# EAGLE design PennyMan_Ard_R3_Shield_v9.4 (EAGLE 9.0.0)
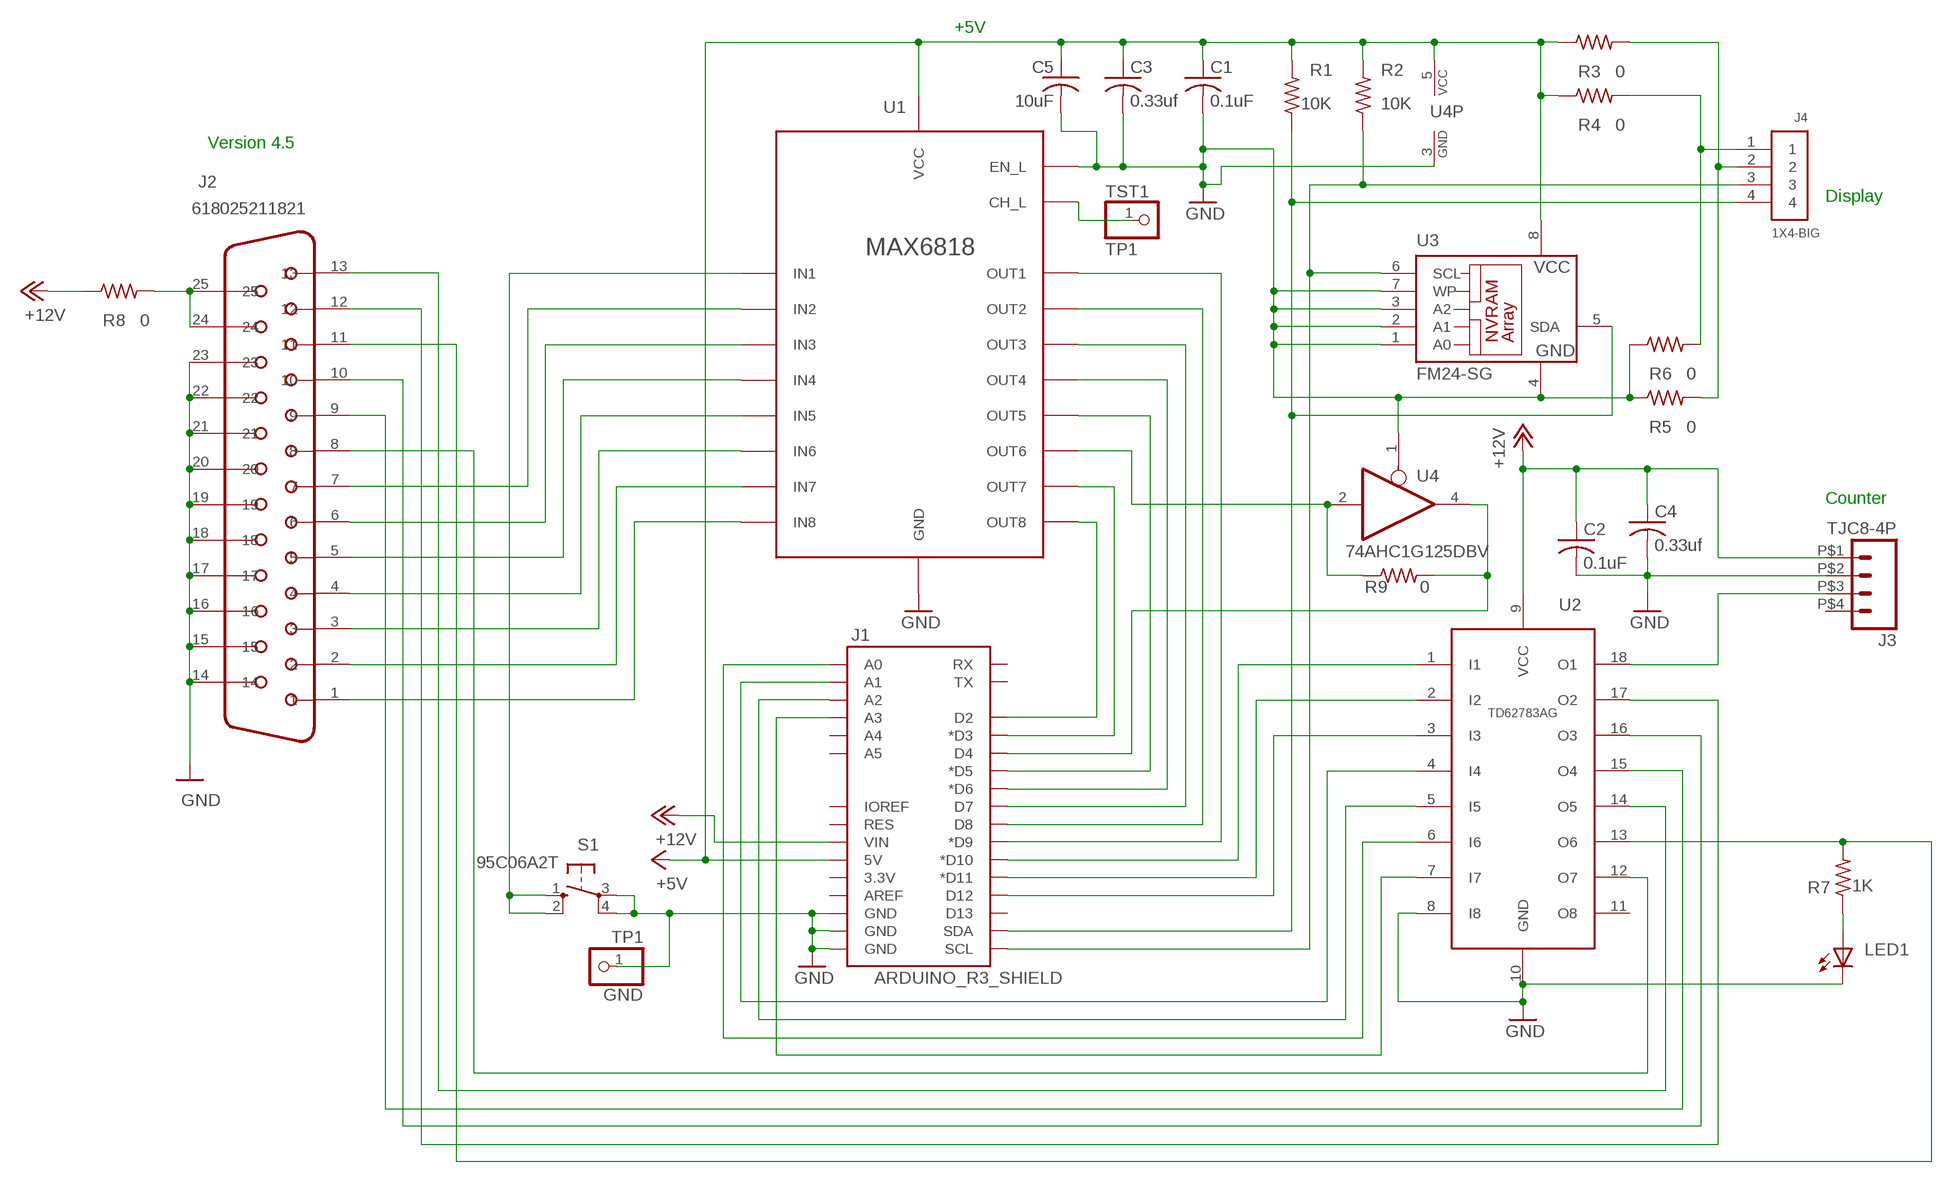
[diagram p0: schematic, sheet 1]

## Parts
C1  0.1uF  C-USC0805  [C0805]
C2  0.1uF  C-USC0805  [C0805]
C3  0.33uf  C-USC1206  [C1206]
C4  0.33uf  C-USC1206  [C1206]
C5  10uF  C-USC1812  [C1812]
GND  TP1  PINHD-1X1  [1X01]
J1  ARDUINO_R3_SHIELD  [UNO_R3_SHIELD]
J2  618025211821  [618025211821]
J3  TJC8-4P  [TJC8-4P]
J4  1X4-BIG  [1X04-BIG]
LED1  LEDSML0805  [SML0805]
R1  10K  R-US_R0805  [R0805]
R2  10K  R-US_R0805  [R0805]
R3  0  R-US_R0805  [R0805]
R4  0  R-US_R0805  [R0805]
R5  0  R-US_R0805  [R0805]
R6  0  R-US_R0805  [R0805]
R7  1K  R-US_R0805  [R0805]
R8  0  R-US_R0805  [R0805]
R9  0  R-US_R0805  [R0805]
S1  95C06A2T  10-XX  [B3F-10XX]
TST1  TP1  PINHD-1X1  [1X01]
U1  MAX6818  [SSOP20]
U2  TD62783AG  [SOP18]
U3  FM24-SG  [SO8]
U4  74AHC1G125DBV  [SOT23-5]

## Nets
+5V: C1.1 C3.1 C5.1 J1.5V R1.2 R2.2 R3.1 R4.1 U1.VCC U3.8(VCC) U4.5(VCC)
+12V: C2.1 C4.1 J1.VIN J3.P$1 R8.1 U2.9(VCC)
GND: C1.2 C2.2 C3.2 C4.2 C5.2 GND.1 J1.GND@0(GND) J1.GND@1(GND) J1.GND@2(GND) J2.14 J2.15 J2.16 J2.17 J2.18 J2.19 J2.20 J2.21 J2.22 J2.23 J3.P$2 LED1.C R5.1 R6.1 S1.3(P) S1.4(P1) U1.EN_L U1.GND U2.8(I8) U2.10(GND) U3.1(A0) U3.2(A1) U3.3(A2) U3.4(GND) U3.7(WP) U4.1(OE) U4.3(GND)
N$1: J2.1 U1.IN8
N$2: J2.2 U1.IN7
N$3: J2.3 U1.IN6
N$4: J2.4 U1.IN5
N$5: J2.5 U1.IN4
N$6: J2.6 U1.IN3
N$7: J2.7 U1.IN2
N$8: J1.D9(*D9) U1.OUT1
N$9: J1.D8 U1.OUT2
N$10: J1.D7 U1.OUT3
N$11: J1.D6(*D6) U1.OUT4
N$12: J1.D5(*D5) U1.OUT5
N$14: J1.D3(*D3) U1.OUT7
N$15: J3.P$3 U2.18(O1)
N$16: J1.D2 U1.OUT8
N$17: J1.A0 U2.6(I6)
N$18: J1.D10(*D10) U2.1(I1)
N$19: J1.D11(*D11) U2.2(I2)
N$20: J1.D12 U2.3(I3)
N$21: J1.A1 U2.4(I4)
N$22: J2.12 U2.17(O2)
N$23: J2.10 U2.16(O3)
N$24: J2.9 U2.15(O4)
N$25: TST1.1 U1.CH_L
N$26: J1.SCL J4.3 R2.1 U3.6(SCL)
N$27: J2.13 U2.14(O5)
N$28: J4.1 R4.2 R6.2
N$29: J1.SDA J4.4 R1.1 U3.5(SDA)
N$30: J4.2 R3.2 R5.2
N$31: J1.D4 R9.2 U4.4(O)
N$32: J1.A2 U2.5(I5)
N$33: LED1.A R7.1
N$34: J2.11 R7.2 U2.13(O6)
N$35: S1.1(S) S1.2(S1) U1.IN1
N$36: J1.A3 U2.7(I7)
N$37: J2.8 U2.12(O7)
N$38: J2.24 J2.25 R8.2
N$40: R9.1 U1.OUT6 U4.2(I)
Unconnected: J1.3.3V J1.A4 J1.A5 J1.AREF J1.D13 J1.IOREF J1.RES J1.RX J1.TX J3.P$4 U2.11(O8)

## Notes on the sheet
- +5V
- Version 4.5
- Display
- Counter

## Library data of the parts
C1-C5 = resistor:C-US: CAPACITOR, American symbol
GND TST1 = adafruit:PINHD-1X1: Pin header 1x1 for 0.1" spacing With round pins
J1 = SparkFun-Boards:ARDUINO_R3_SHIELD: Shield form compatible with the Arduino Uno R3.
J2 = EagleLibrary_Wuerth_Elektronik_eiCan_Communication_Connectors_v4_20150113:618025211821: WR-DSUB 8.08mm Female Angled PCB Connector without Hex Screw, 25 Pins=>Code : Con_I-O_DSUB_PCB_Female_wo-screw_618025211821 <http://katalog.we-online.de/media/images/eican/Con_I-O_DSUB_PCB_Female_wo-screw_6180xx211821_pf2.jpg> Details see: http://katalog.we-online.de/en/em/618_0xx_211_821 Created 2014-07-10, Karrer Zheng 2014 (C) Würth Elektronik
J3 = NDN:TJC8-4P
J4 = adafruit:1X4: 4-pin connector
LED1 = led:LED: LED OSRAM: - CHIPLED LG R971, LG N971, LY N971, LG Q971, LY Q971, LO R971, LY R971 LH N974, LH R974 LS Q976, LO Q976, LY Q976 LO Q996 - Hyper CHIPLED LW Q18S LB Q993, LB Q99A, LB R99A - SideLED LS A670, LO A670, LY A670, LG A670, LP A670 LB A673, LV A673, LT A673, LW A673 LH A674 LY A675 LS A676, LA A676, LO A676, LY A676, LW A676 LS A679, LY A679, LG A679 - Hyper Micro SIDELED® LS Y876, LA Y876, LO Y876, LY Y876 LT Y87S - SmartLED LW L88C, LW L88S LB L89C, LB L89S, LG L890 LS L89K, LO L89K, LY L89K LS L896, LA L896, LO L896, LY L896 - TOPLED LS T670, LO T670, LY T670, LG T670, LP T670 LSG T670, LSP T670, LSY T670, LOP T670, LYG T670 LG T671, LOG T671, LSG T671 LB T673, LV T673, LT T673, LW T673 LH T674 LS T676, LA T676, LO T676, LY T676, LB T676, LH T676, LSB T676, LW T676 LB T67C, LV T67C, LT T67C, LS T67K, LO T67K, LY T67K, LW E67C LS E67B, LA E67B, LO E67B, LY E67B, LB E67C, LV E67C, LT E67C LW T67C LS T679, LY T679, LG T679 LS T770, LO T770, LY T770, LG T770, LP T770 LB T773, LV T773, LT T773, LW T773 LH T774 LS E675, LA E675, LY E675, LS T675 LS T776, LA T776, LO T776, LY T776, LB T776 LHGB T686 LT T68C, LB T68C - Hyper Mini TOPLED® LB M676 - Mini TOPLED Santana® LG M470 LS M47K, LO M47K, LY M47K Source: http://www.osram.convergy.de LUXEON: - LUMILED® LXK2-PW12-R00, LXK2-PW12-S00, LXK2-PW14-U00, LXK2-PW14-V00 LXK2-PM12-R00, LXK2-PM12-S00, LXK2-PM14-U00 LXK2-PE12-Q00, LXK2-PE12-R00, LXK2-PE12-S00, LXK2-PE14-T00, LXK2-PE14-U00 LXK2-PB12-K00, LXK2-PB12-L00, LXK2-PB12-M00, LXK2-PB14-N00, LXK2-PB14-P00, LXK2-PB14-Q00 LXK2-PR12-L00, LXK2-PR12-M00, LXK2-PR14-Q00, LXK2-PR14-R00 LXK2-PD12-Q00, LXK2-PD12-R00, LXK2-PD12-S00 LXK2-PH12-R00, LXK2-PH12-S00 LXK2-PL12-P00, LXK2-PL12-Q00, LXK2-PL12-R00 Source: www.luxeon.com KINGBRIGHT: KA-3528ASYC Source: www.kingbright.com
R1-R9 = resistor:R-US_: RESISTOR, American symbol
S1 = switch-omron:10-XX: OMRON SWITCH
U1 = NDN:MAX6818
U2 = NDN:TD62783AG: Octal High-side driver
U3 = ramtron:FM24*: I2C NVRAM 8 pin
U4 = 74xx-little-us:74*1G125: Single Bus Buffer Gate with 3-State Output

## Net classes
0 default: clearance 0.205 mm

## Board
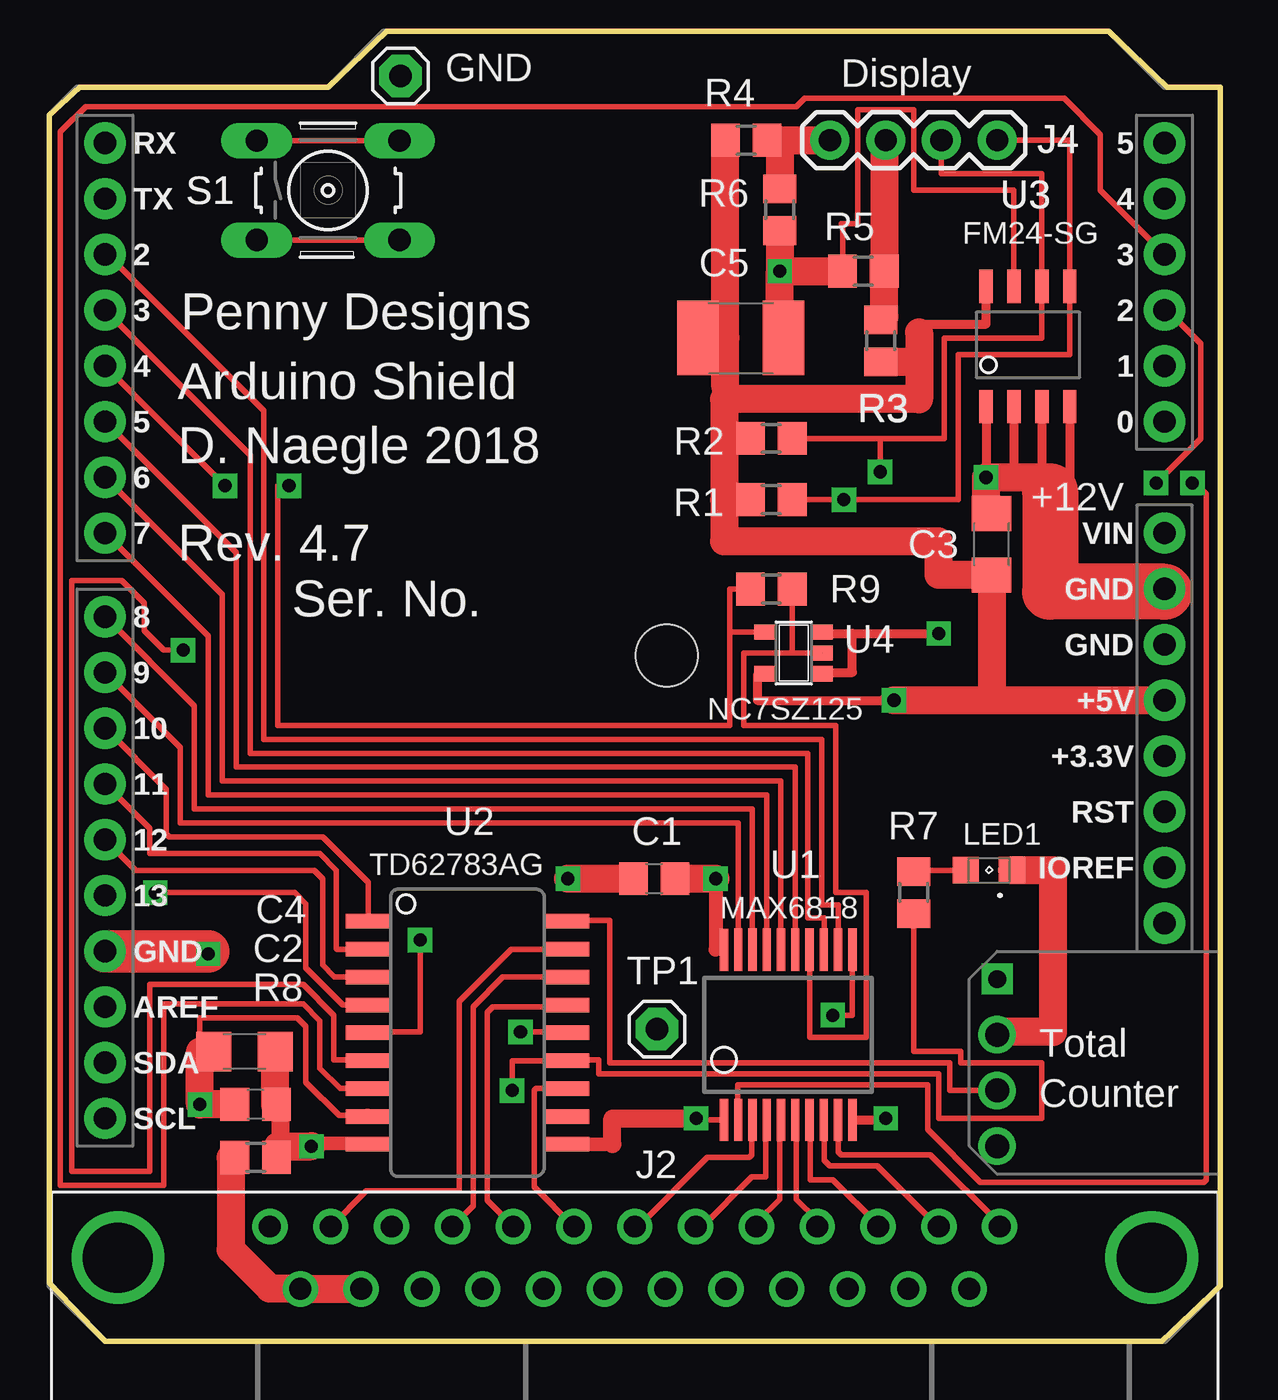
[diagram p1: board, top side]
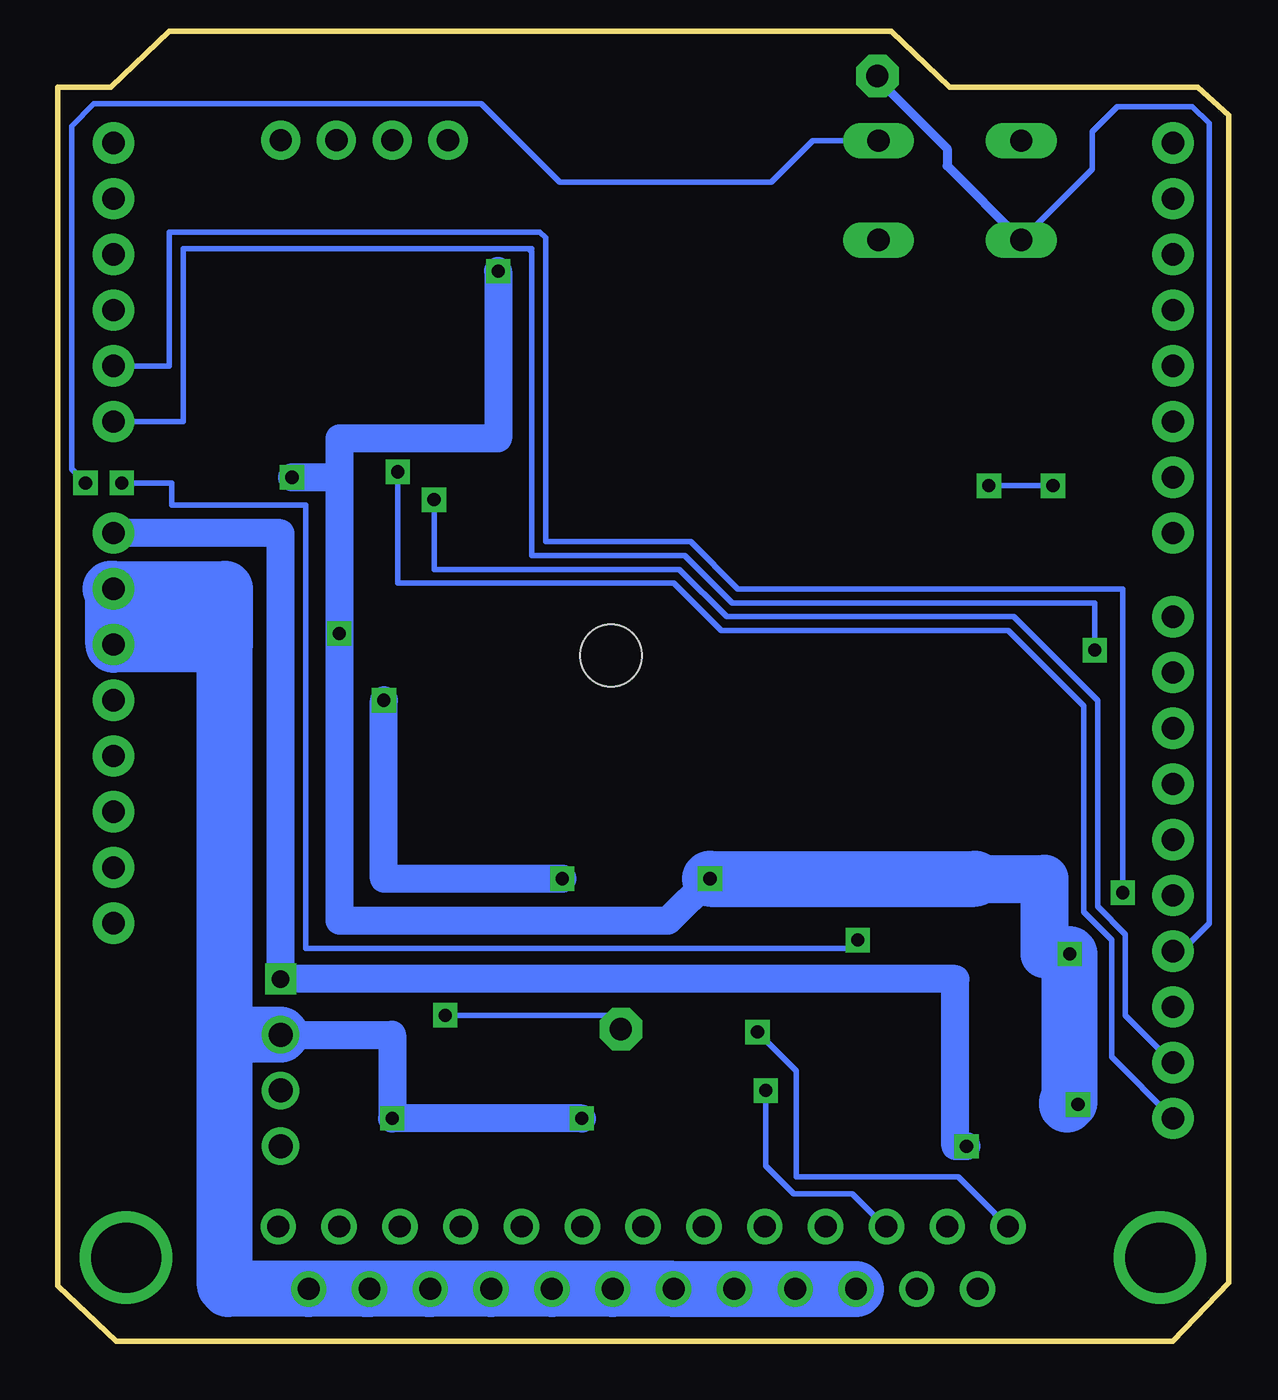
[diagram p2: board, bottom side, seen from below]

No outline drawn. Coordinates in mm, seen from the top.
Copper layers (1*16): Top 0.035mm / dielectric 1.5mm / Bottom 0.035mm
Design rules "SparkFun *": minimum track width 8mil, minimum drill 20mil, track to track 8mil, track to pad 8mil, pad to pad 8mil, via to via 8mil, smd to smd 8mil, copper to edge 10mil, drill to drill 8mil, minimum pad ring 12mil, minimum via ring 10mil, stop-mask expansion 0mil, vias tented up to drill 25mil, thermal gap 10mil
Holes 2.8 mm at 28,31.25

### Footprints (pad centres in the part's own frame; a part is rotated, then mirrored left to right if it is on the bottom)
C0805 = smd 1.3 x 1.5: 1 -0.95,0; 2 0.95,0
C1206 = smd 1.6 x 1.8: 1 -1.4,0; 2 1.4,0
C1812 = smd 1.9 x 3.4: 1 -1.95,0; 2 1.95,0
1X01 = drill 1.016 pad 1.93 octagon: 1 0,0
UNO_R3_SHIELD = drill 1.016 pad 1.88: 3.3V 50.8,26.67; 5V 50.8,29.21; A0 50.8,41.91; A1 50.8,44.45; A2 50.8,46.99; A3 50.8,49.53; A4 50.8,52.07; A5 50.8,54.61; AREF 2.54,15.24; D2 2.54,49.53; D3 2.54,46.99; D4 2.54,44.45; D5 2.54,41.91; D6 2.54,39.37; D7 2.54,36.83; D8 2.54,33.02; D9 2.54,30.48; D10 2.54,27.94; D11 2.54,25.4; D12 2.54,22.86; D13 2.54,20.32; GND@0 50.8,31.75; GND@1 50.8,34.29; GND@2 2.54,17.78; IOREF 50.8,21.59; NC 50.8,19.05; RES 50.8,24.13; RX 2.54,54.61; SCL 2.54,10.16; SDA 2.54,12.7; TX 2.54,52.07; VIN 50.8,36.83
618025211821 = drill 1: 1 16.62,1.42; 2 13.85,1.42; 3 11.08,1.42; 4 8.31,1.42; 5 5.54,1.42; 6 2.77,1.42; 7 0,1.42; 8 -2.77,1.42; 9 -5.54,1.42; 10 -8.31,1.42; 11 -11.08,1.42; 12 -13.85,1.42; 13 -16.62,1.42; 14 15.235,-1.42; 15 12.465,-1.42; 16 9.695,-1.42; 17 6.925,-1.42; 18 4.155,-1.42; 19 1.385,-1.42; 20 -1.385,-1.42; 21 -4.155,-1.42; 22 -6.925,-1.42; 23 -9.695,-1.42; 24 -12.465,-1.42; 25 -15.235,-1.42 | drill 3.2: Z1 -23.55,0; Z2 23.55,0
TJC8-4P = drill 0.8 square: P$1 -3.81,0 | drill 1.1: P$2 -1.27,0; P$3 1.27,0; P$4 3.81,0
1X04-BIG = drill 1.016 pad 1.778: 1 0,0; 2 2.54,0; 3 5.08,0; 4 7.62,0
SML0805 = smd 1.2 x 1.2: A 1.05,0; C -1.05,0
R0805 = smd 1.3 x 1.5: 1 -0.95,0; 2 0.95,0
B3F-10XX = drill 1.016 long: 1 -3.251,2.261; 2 3.251,2.261; 3 -3.251,-2.261; 4 3.251,-2.261
SSOP20 = smd 0.381 x 1.93: CH_L 2.925,3.879; EN_L -2.925,-3.879; GND 2.925,-3.879; IN1 -2.275,-3.879; IN2 -1.625,-3.879; IN3 -0.975,-3.879; IN4 -0.325,-3.879; IN5 0.325,-3.879; IN6 0.975,-3.879; IN7 1.625,-3.879; IN8 2.275,-3.879; OUT1 -2.275,3.879; OUT2 -1.625,3.879; OUT3 -0.975,3.879; OUT4 -0.325,3.879; OUT5 0.325,3.879; OUT6 0.975,3.879; OUT7 1.625,3.879; OUT8 2.275,3.879; VCC -2.917,3.868
SOP18 = smd 0.66 x 2.032: 1 -3.9,-4.525; 2 -2.625,-4.525; 3 -1.36,-4.525; 4 -0.09,-4.525; 5 1.18,-4.525; 6 2.45,-4.525; 7 3.72,-4.525; 8 4.99,-4.525; 9 6.26,-4.525; 10 6.26,4.525; 11 4.99,4.525; 12 3.72,4.525; 13 2.45,4.525; 14 1.18,4.525; 15 -0.09,4.525; 16 -1.36,4.525; 17 -2.63,4.525; 18 -3.9,4.525
SO8 = smd 0.61 x 1.524: 1 -1.27,-2.743; 2 0,-2.743; 3 1.27,-2.743; 4 2.54,-2.743; 5 2.54,2.743; 6 1.27,2.743; 7 0,2.743; 8 -1.27,2.743
SOT23-5 = smd 0.69 x 0.99: 1 -0.95,-1.29; 2 0,-1.29; 3 0.95,-1.29; 4 0.95,1.3; 5 -0.95,1.3

### Placement (x,y rotation side)
C1  27.43,21.08 180 top
C2  9.27,10.79 180 top
C3  42.8,36.32 90 top
C4  8.76,13.21 180 top
C5  31.37,45.72 0 top
GND  15.88,57.66 0 top
J1  -0.13,0 0 top
J2  26.54,3.81 0 top
J3  43.05,12.7 270 top
J4  35.43,54.74 0 top
LED1  42.67,21.46 180 top
R1  32.77,38.35 180 top
R2  32.77,41.15 180 top
R3  37.75,45.59 90 top
R4  31.62,54.74 0 top
R5  36.96,48.77 0 top
R6  33.15,51.56 90 top
R7  39.24,20.45 270 top
R8  9.27,8.38 180 top
R9  32.77,34.29 180 top
S1  12.57,52.45 0 top
TST1  27.56,14.22 0 top
U1  33.53,13.97 0 top
U2  18.92,15.24 270 top
U3  43.81,45.34 0 top
U4  33.78,31.37 90 top

### Tracks (layer width: path | path; a pad name or v marks a point on that pad's centre or on a via)
+5V  (via drill 0.6)
  Top 0.203: 30.82,43.47 30.67,43.47
  Top 0.254: R2.2 30.48,41.15 30.48,38.35 30.61,38.35 R1.2 | 30.23,17.85 U1.VCC | 39.55,46.35 39.55,46.02 39.5,45.97 | 32.13,30.35 32.48,30.35 | 30.67,43.47 30.67,42.99 | 30.67,42.55 30.67,42.99 | 30.67,42.99 30.61,42.93
  Top 0.406: 39.55,46.35 42.55,46.35 U3.8 | 32.13,30.35 32.13,29.21 v38.35,29.21 | 32.48,30.35 U4.5
  Top 0.635: v30.23,21.08 30.23,17.85
  Top 1.27: v30.23,21.08 C1.1 | J1.5V 42.8,29.21 | 30.67,43.47 30.67,45.72 | 30.67,45.72 R4.1 | C5.1 30.67,45.72 | 42.8,29.21 C3.1 40.39,34.92 40.39,36.45 30.61,36.45 30.61,38.35 30.61,42.93 39.5,42.93 39.5,44.58 | 42.8,29.21 v38.35,29.21 | 39.5,45.97 39.5,44.58 | R3.1 39.43,44.64 39.5,44.58
  Bottom 1.27: v30.23,21.08 38.35,21.08 v38.35,29.21
+12V  (via drill 0.6)
  Top 0.254: 14.4,9.02 U2.9 | R8.1 10.29,8.45 10.29,8.89
  Top 0.61: 14.4,9.02 11.94,9.02 v11.81,8.89
  Top 0.813: 11.94,9.02 10.41,9.02 10.41,10.79 C2.1
  Top 1.27: 10.29,8.89 v11.81,8.89 | C2.1 10.16,10.79 C4.1
  Bottom 1.27: J1.VIN 43.05,36.83 J3.P$1 12.32,16.51 12.32,8.89 v11.81,8.89
GND  (via drill 0.6)
  Top 0.203: 50.62,34.29 50.62,34.16
  Top 0.254: S1.3 S1.4 | U3.7 43.81,52.45 39.24,52.45 39.24,56.13 36.7,56.13 36.7,50.93 35.94,50.93 35.94,50.8 36.01,50.8 R5.1 | 37.9,10.09 v37.97,10.16 | U1.EN_L 29.41,10.09 v29.34,10.16 | 14.36,10.29 13.08,10.29 11.56,11.81 11.56,14.35 11.18,14.73 6.73,14.73 6.73,13.21 | 35.31,32.26 35.07,32.26 U4.3 | J1.GND@1 50.62,34.29 | U4.1 34.99,30.42 arc90 35.05,30.48
  Top 0.406: U3.1 v42.55,39.37 | U3.2 43.81,39.37 | U3.3 45.09,39.37 | U3.4 46.35,39.37 45.47,39.37 | U1.GND 37.9,10.09 | 15.82,50.29 S1.4 | 35.31,32.26 36.45,32.26 | 36.45,32.26 v40.39,32.26 | 35.05,30.48 36.45,30.48 36.45,32.26
  Top 0.61: U2.10 25.53,8.98
  Top 0.635: U2.8 14.36,10.29
  Top 0.813: 25.53,8.98 25.53,10.16 v29.34,10.16
  Top 1.27: C3.2 42.54,37.72 v42.54,39.37 v42.55,39.37 43.81,39.37 45.09,39.37 45.47,39.37 45.47,38.73 | R6.1 v33.15,48.77 | v33.15,48.77 R5.1 | C5.2 33.15,45.72 v33.15,48.77 | C2.2 v6.73,10.79 6.73,13.21 C4.2 | J3.P$2 43.05,14.1 45.59,14.1 45.59,21.46 LED1.C | 7.11,17.78 v7.11,17.65 | C1.2 v23.5,21.08
  Top 1.93: J1.GND@2 7.11,17.78
  Top 2.54: 50.67,34.16 50.62,34.16 45.47,34.16 45.47,38.73
  Bottom 0.203: 36.33,2.45 36.33,2.39 | 39.19,2.45 39.19,2.39 | 6.74,10.82 7.24,10.82
  Bottom 0.254: 11.3,21.21 11.43,21.08 | J1.GND@2 2.03,17.78 0.76,19.05 0.76,55.5 1.52,56.26 4.95,56.26 6.1,55.12 6.1,53.42 S1.3 | v6.73,10.79 6.71,10.79 6.74,10.82
  Bottom 0.406: 45.44,2.39 45.59,2.54 | GND.1 15.88,57.53 12.7,54.36 12.7,53.57 S1.3
  Bottom 1.27: 40.39,39.37 v40.39,32.26 40.39,19.18 25.4,19.18 v23.5,21.08 | J3.P$2 37.97,13.97 v37.97,10.16 v29.34,10.16 | v33.15,48.77 33.15,41.15 40.39,41.15 40.39,39.37 | 40.39,39.37 v42.54,39.37 v42.55,39.37
  Bottom 2.184: v7.11,17.65 8.26,17.65 8.26,21.08 11.43,21.08
  Bottom 2.54: 50.8,34.29 45.59,34.29 45.59,31.75 | 45.59,2.54 45.59,13.97 | J3.P$2 45.59,13.97 | J1.GND@1 J1.GND@0 45.59,31.75 | 45.59,13.97 45.59,31.75 | J2.23 J2.22 J2.21 J2.20 J2.19 J2.18 J2.17 J2.16 36.33,2.39 J2.15 39.19,2.39 J2.14 45.44,2.39 | v7.11,17.65 7.11,10.9 7.24,10.9 7.24,10.82 7.24,10.79 | v23.5,21.08 11.43,21.08
N$1
  Top 0.254: J2.1 43.16,5.35 40.01,8.51 35.94,8.51 35.81,8.64 35.81,10.08 U1.IN8
N$2
  Top 0.254: J2.2 40.36,5.23 37.59,8 35.43,8 35.18,8.26 35.18,10.06 U1.IN7
N$3
  Top 0.254: J2.3 37.62,5.3 35.56,7.37 34.54,7.37 34.54,10.05 U1.IN6
N$4
  Top 0.254: J2.4 34.85,5.53 33.91,6.48 33.91,10.04 U1.IN5
N$5
  Top 0.254: J2.5 32.08,5.41 33.15,6.48 33.15,10.04 U1.IN4
N$6
  Top 0.254: J2.6 29.61,5.23 31.88,7.49 32.51,7.49 32.51,10.05 U1.IN3
N$7
  Top 0.254: J2.7 26.69,5.23 29.84,8.38 31.75,8.38 31.88,8.51 31.88,10.06 U1.IN2
N$8
  Top 0.254: J1.D9 5.84,27.05 5.84,23.62 31.25,23.62 U1.OUT1
N$9
  Top 0.254: U1.OUT2 31.9,24.26 6.48,24.26 6.48,28.96 J1.D8
N$10
  Top 0.254: U1.OUT3 32.55,24.89 7.11,24.89 7.11,32.13 J1.D7
N$11
  Top 0.254: U1.OUT4 33.2,25.53 7.75,25.53 7.75,34.04 J1.D6
N$12
  Top 0.254: U1.OUT5 33.85,26.16 8.38,26.16 8.38,35.94 J1.D5
N$14
  Top 0.203: 35.1,17.96 35.18,17.96
  Top 0.254: J1.D3 9.02,40.39 9.02,26.8 34.42,26.8 34.42,19.3 35.18,19.3 35.18,17.96 | 35.18,17.59 35.18,17.96 | U1.OUT7 35.18,17.88 35.18,17.96
N$15
  Top 0.254: J3.P$3 40.89,11.43 40.89,12.7 25.4,12.7 25.4,19.18 24.26,19.18 | 23.5,19.18 24.26,19.18 | 24.26,19.18 23.48,19.18 U2.18
N$16
  Top 0.254: J1.D2 2.54,49.53 9.65,42.42 9.65,27.43 35.05,27.43 35.05,19.89 35.81,19.89 35.81,18.29 arc90 35.8,18.28 U1.OUT8
N$17  (via drill 0.6)
  Top 0.254: v5.97,31.5 5.08,31.5 4.19,32.38 4.19,33.66 3.17,34.67 0.89,34.67 0.89,7.75 4.45,7.75 4.45,16.26 11.43,16.26 12.83,14.86 12.83,12.83 14.36,12.83 U2.6
  Bottom 0.254: 31.75,49.78 47.5,49.78 47.5,41.91 J1.A0 | 31.75,49.78 31.62,49.78 | v5.97,31.5 5.97,33.66 22.48,33.66 24.64,35.81 31.62,35.81 31.62,49.66 31.75,49.78
N$18
  Top 0.254: U2.1 14.4,20.91 12.32,22.99 5.33,22.99 5.21,23.11 5.21,25.15 J1.D10
N$19
  Top 0.254: J1.D11 4.45,23.37 4.45,22.23 12.19,22.23 12.95,21.46 12.95,17.91 13,17.86 U2.2
N$20
  Top 0.254: U2.3 12.86,16.6 12.32,17.14 12.32,21.08 11.94,21.46 3.81,21.46 J1.D12
N$21  (via drill 0.6)
  Top 0.254: v4.7,20.45 11.05,20.45 11.56,19.94 11.56,17.02 13.24,15.33 U2.4
  Bottom 0.254: v4.7,20.45 4.7,34.29 22.23,34.29 24.38,36.45 30.99,36.45 30.99,50.29 31.24,50.55 48.13,50.55 48.13,44.45 J1.A1
N$22
  Top 0.254: U2.17 20.92,17.87 18.54,15.49 18.54,6.86 14.32,6.86 J2.12
N$23
  Top 0.254: U2.16 20.54,16.6 19.18,15.24 19.18,6.17 J2.10
N$24
  Top 0.254: 23.5,15.33 23.5,15.37 arc-90 U2.15 23.36,15.24 20.07,15.24 19.81,14.99 19.81,6.42 J2.9
N$25  (via drill 0.6)
  Top 0.254: U1.CH_L 36.45,14.86 v35.56,14.86
  Bottom 0.254: v35.56,14.86 28.19,14.86 TST1.1
N$26  (via drill 0.6)
  Top 0.254: J4.3 40.51,53.21 45.09,53.21 U3.6 45.09,45.72 40.64,45.72 40.64,41.15 37.72,41.15 | R2.1 37.72,41.15 | v37.72,39.62 37.72,41.15
  Bottom 0.254: J1.SCL 5.21,12.95 5.21,18.29 6.48,19.56 6.48,28.96 9.91,32.38 22.99,32.38 25.15,34.54 37.72,34.54 v37.72,39.62
N$27  (via drill 0.6)
  Top 0.254: U2.14 23.48,14.1 v21.34,14.1
  Bottom 0.254: 9.91,5.23 J2.13 | J2.13 10.54,5.84 | J2.13 12.19,7.49 19.56,7.49 19.56,12.32 v21.34,14.1
N$28
  Top 1.27: J4.1 R4.2 33.15,54.74 R6.2
N$29  (via drill 0.6)
  Top 0.254: J4.4 46.35,54.74 U3.5 46.35,44.96 41.27,44.96 41.27,38.35 v36.07,38.35 R1.1 33.66,38.29
  Bottom 0.254: J1.SDA 4.57,14.86 4.57,18.54 5.84,19.81 5.84,29.21 9.65,33.02 22.73,33.02 24.89,35.18 36.07,35.18 v36.07,38.35
N$30
  Top 1.27: J4.2 37.91,54.74 R5.2 37.91,46.7 R3.2
N$31  (via drill 0.6)
  Top 0.254: v7.87,38.99 J1.D4 | v10.79,38.99 10.29,38.99 10.29,28.07 30.86,28.07 30.86,32.32 | 30.86,32.32 30.86,34.29 R9.2 | U4.4 30.86,32.32
  Bottom 0.254: v7.87,38.99 v10.79,38.99
N$32  (via drill 0.6)
  Top 0.254: J1.A2 50.8,46.99 52.32,45.47 52.32,41.15 v50.29,39.12 | v16.76,18.29 16.76,14.1 14.4,14.1 U2.5
  Bottom 0.254: v50.29,39.12 48.01,39.12 48.01,38.1 41.91,38.1 41.91,17.91 16.76,17.91 v16.76,18.29
N$33
  Top 0.254: LED1.A 39.31,21.46
  Top 0.305: 39.31,21.46 R7.1
N$34  (via drill 0.6)
  Top 0.254: v20.95,11.43 20.95,12.79 U2.13 23.45,12.83 24.89,12.83 24.89,12.19 40.39,12.19 40.39,10.16 45.09,10.16 45.09,12.7 41.4,12.7 41.4,13.21 39.24,13.21 R7.2
  Bottom 0.254: J2.11 15.52,5.23 17.02,6.73 19.68,6.73 20.95,8 v20.95,11.43
N$35  (via drill 0.6)
  Top 0.254: S1.1 S1.2 | v51.94,39.12 52.07,39.12 52.58,38.61 52.58,7.37 52.45,7.24 42.29,7.24 39.88,9.65 39.88,11.68 31.24,11.68 31.24,10.1 U1.IN1
  Bottom 0.254: S1.2 18.82,54.71 20.7,52.83 30.35,52.83 33.91,56.39 51.56,56.39 52.58,55.37 52.58,39.75 v51.94,39.12
N$36
  Top 0.254: J1.A3 47.75,52.45 47.75,54.99 46.1,56.64 34.29,56.64 33.91,56.26 1.52,56.26 0.38,55.12 0.38,7.11 5.08,7.11 5.08,15.37 11.43,15.37 12.19,14.61 12.19,12.45 13.12,11.52 U2.7
N$37
  Top 0.254: U2.12 22.06,11.52 21.97,11.43 21.97,7.03 J2.8
N$38
  Top 1.27: J2.24 J2.25 11.29,2.41 9.91,2.41 8.13,4.19 8.13,8.38 R8.2
N$40
  Top 0.254: U1.OUT6 34.5,13.88 34.54,13.84 37.08,13.84 37.08,20.45 35.69,20.45 35.69,28.07 31.5,28.07 31.5,31.37 33.72,31.37 | 33.72,31.37 U4.2 | 33.72,31.37 R9.1

### Text on the board
tPlace: GND | Display | Penny Designs | Arduino Shield | D. Naegle 2018 | +12V | Rev. 4.7 | Ser. No. | NC7SZ125 | Total | Counter
_tPlace: J4 | J4 | J4 | J4 | S1 | S1 | U3 | U3 | U3 | U3 | R3 | R3 | R3